# EAGLE design amplificador_stereo (EAGLE 9.6.0)
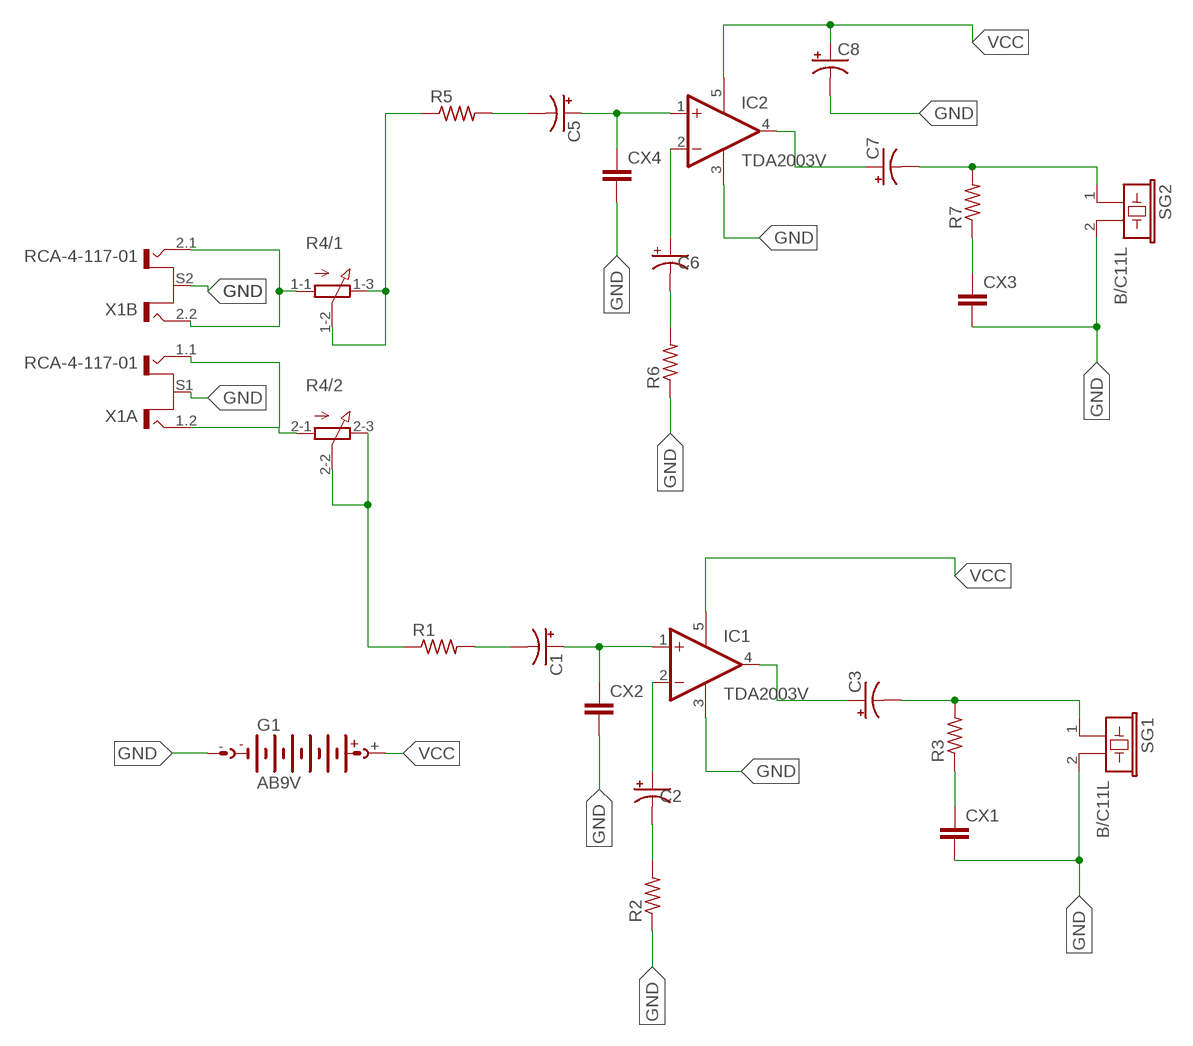
[diagram p0: schematic, sheet 1]

## Parts
C1  CPOL-USB45181B  [B45181B]
C2  CPOL-USB45181B  [B45181B]
C3  CPOL-USB45181B  [B45181B]
C5  CPOL-USB45181B  [B45181B]
C6  CPOL-USB45181B  [B45181B]
C7  CPOL-USB45181B  [B45181B]
C8  CPOL-USB45181B  [B45181B]
CX1  CXXC10B6  [XC10B6]
CX2  CXXC10B6  [XC10B6]
CX3  CXXC10B6  [XC10B6]
CX4  CXXC10B6  [XC10B6]
G1  AB9V  [AB9V]
IC1  TDA2003V  [CB360]
IC2  TDA2003V  [CB360]
R1  R-US_0204/7  [0204/7]
R2  R-US_0204/7  [0204/7]
R3  R-US_0204/7  [0204/7]
R4  3RP/1610G  [3RP/1610G]
R5  R-US_0204/7  [0204/7]
R6  R-US_0204/7  [0204/7]
R7  R-US_0204/7  [0204/7]
SG1  B/C11L  [B/C11L]
SG2  B/C11L  [B/C11L]
X1  RCA-4-117-01  [RCA-4-117-01]

## Nets
GND: C8.- CX1.2 CX2.2 CX3.2 CX4.2 G1.- IC1.3(GND) IC2.3(GND) R2.1 R6.1 SG1.2 SG2.2 X1.S1(A:S) X1.S2(B:S)
N$1: C1.- R1.2
N$2: C1.+ CX2.1 IC1.1(+IN)
N$3: C2.+ IC1.2(-IN)
N$4: C2.- R2.2
N$5: R1.1 R4.2-2(/2:S) R4.2-3(/2:E)
N$6: C3.+ IC1.4(OUT)
N$7: C3.- R3.2 SG1.1
N$8: CX1.1 R3.1
N$9: R4.1-1(/1:A) X1.2.1(B:T1) X1.2.2(B:T2)
N$10: C5.- R5.2
N$11: C5.+ CX4.1 IC2.1(+IN)
N$12: C6.+ IC2.2(-IN)
N$13: C6.- R6.2
N$14: C7.+ IC2.4(OUT)
N$15: C7.- R7.2 SG2.1
N$16: CX3.1 R7.1
N$17: R4.1-2(/1:S) R4.1-3(/1:E) R5.1
N$18: R4.2-1(/2:A) X1.1.1(A:T1) X1.1.2(A:T2)
VCC: C8.+ G1.+ IC1.5(V+) IC2.5(V+)

## Library data of the parts
C1-C3 C5-C8 = rcl:CPOL-US: POLARIZED CAPACITOR, American symbol; SPICEPREFIX: C
CX1-CX4 = rcl:CX: X CAPACITOR for power line; SPICEPREFIX: C
G1 = battery:AB9V: 9-V BATTERY CLIP
IC1 IC2 = linear:TDA2003: AUDIO AMPLIFIER
R1-R3 R5-R7 = rcl:R-US_: RESISTOR, American symbol; SPICEPREFIX: R
R4 = pot:3RP/1610G: 16mm Potentiometer two level Source: http://www.alphapotentiometers.net/html/16mm_pot_2.html
SG1 SG2 = buzzer:B/C11L: BUZZER Source: Buerklin; OC_FARNELL: unknown; OC_NEWARK: unknown
X1 = con-amphenol:RCA-4-117-01: RCA JACK DIP R/A 4pos Source: RCA-4-117-01x.pdf

## Board
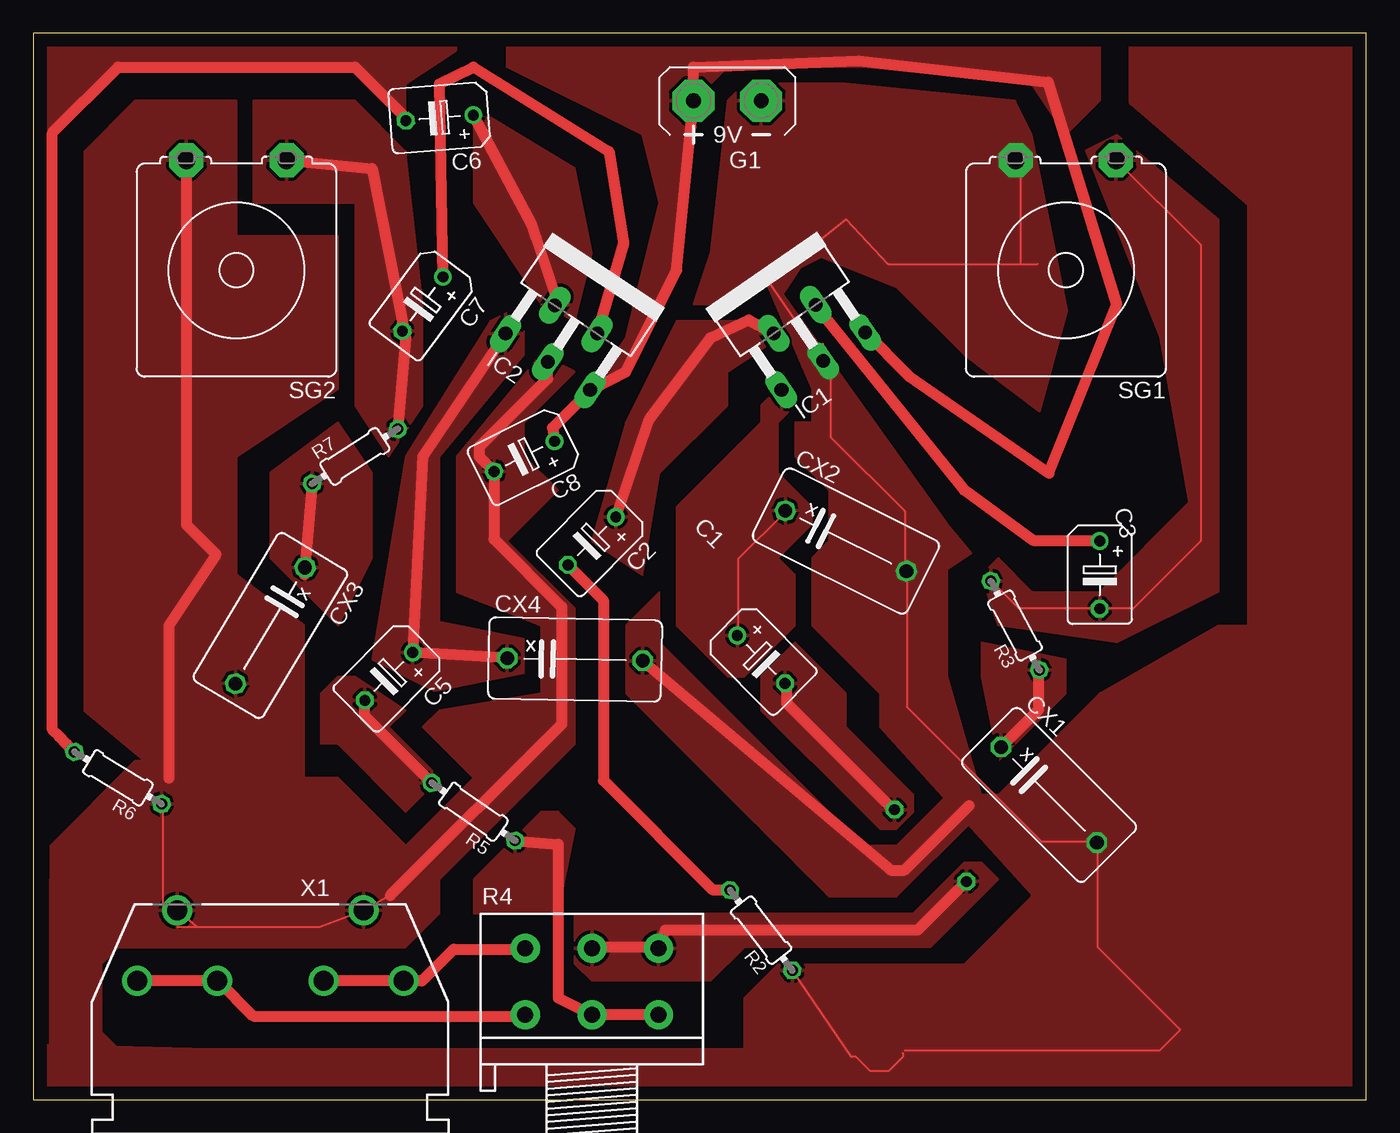
[diagram p1: board, top side]
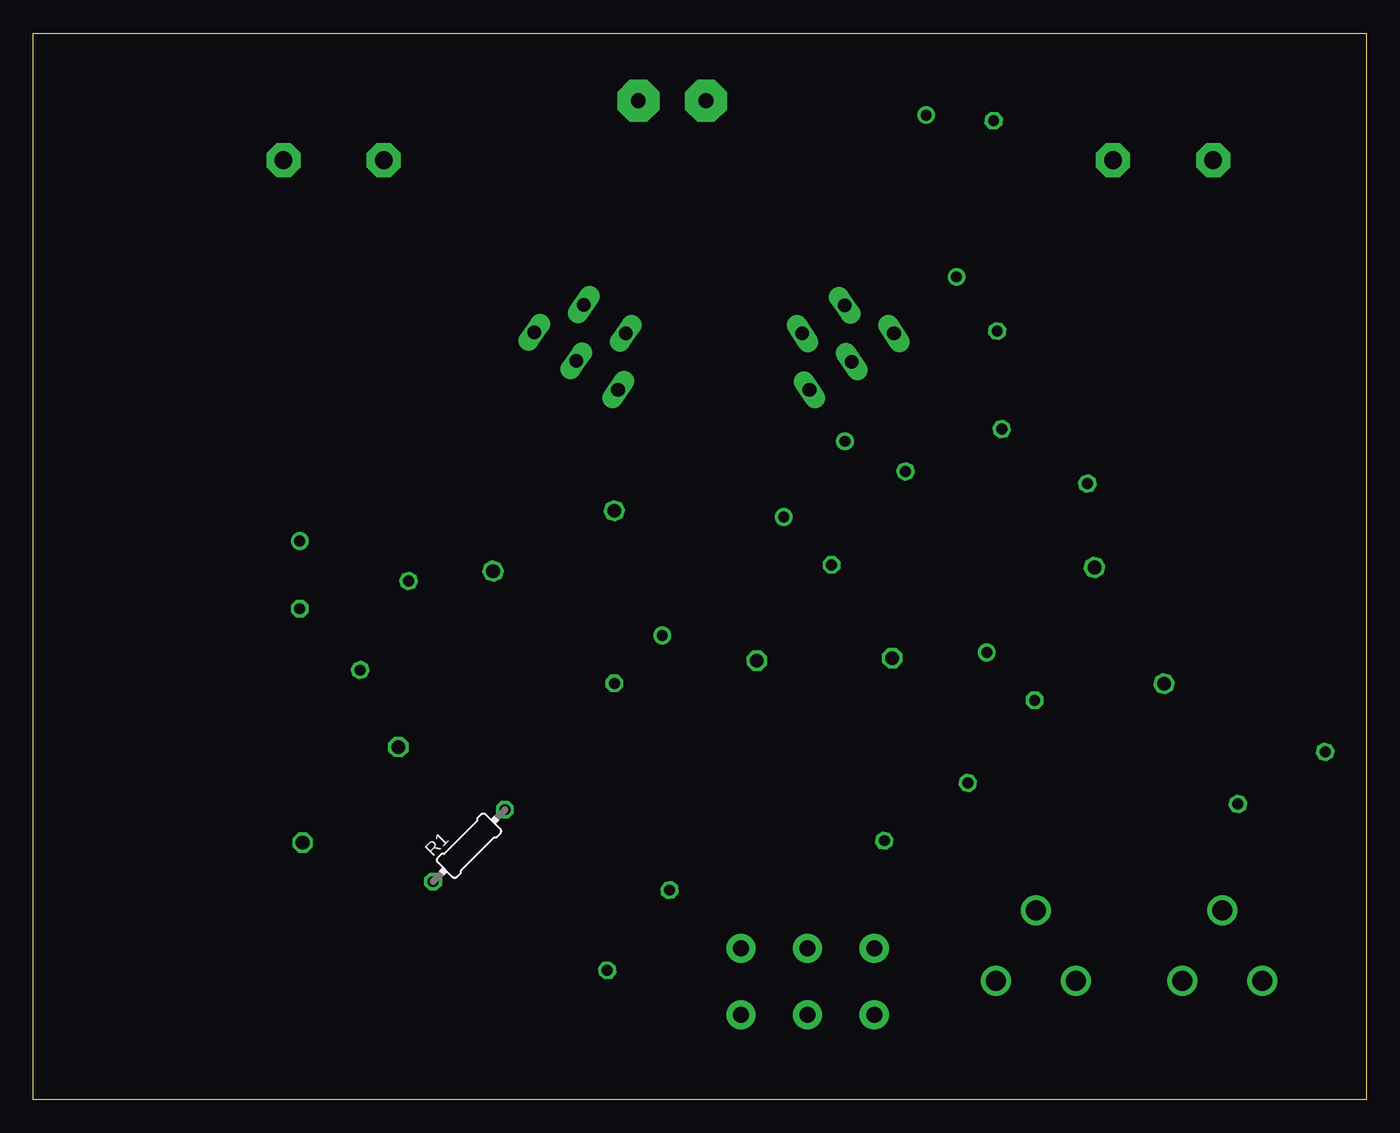
[diagram p2: board, bottom side, seen from below]

Size 100 x 80 mm. Coordinates in mm from the lower left corner, seen from the top.
Outline: 0,0 100,0 100,80 0,80 0,0
Copper layers (1*16): Top 0.035mm / dielectric 1.5mm / Bottom 0.035mm
Design rules "default": minimum track width 6mil, minimum drill 0.35mm, track to track 6mil, track to pad 6mil, pad to pad 6mil, via to via 6mil, smd to smd 6mil, copper to edge 40mil, drill to drill 6mil, minimum pad ring 10mil, minimum via ring 8mil, stop-mask expansion 4mil, vias tented up to drill 0mil, thermal gap 10mil

### Footprints (pad centres in the part's own frame; a part is rotated, then mirrored left to right if it is on the bottom)
B45181B = drill 0.813: + -2.54,0 | drill 0.813 octagon: - 2.54,0
XC10B6 = drill 1.016 octagon: 1 -5.08,0; 2 5.08,0
AB9V = drill 1.118 pad 3.15 octagon: + 0,2.54; - 0,-2.54
CB360 = drill 1.016 long: 1 -3.81,-8.255; 2 -1.905,-4.445; 3 0,-8.255; 4 1.905,-4.445; 5 3.81,-8.255
0204/7 = drill 0.813 octagon: 1 -3.81,0; 2 3.81,0
3RP/1610G = drill 1.2 pad 2.184: 1-1 -5,0; 1-2 0,0; 1-3 5,0; 2-1 -5,5; 2-2 0,5; 2-3 5,5
B/C11L = drill 1.321 pad 2.54 octagon: 1 -3.759,-8.255; 2 3.759,-8.255
RCA-4-117-01 = drill 1.5 pad 2.184: 1.1 -10,0; 1.2 -4,0; 2.1 4,0; 2.2 10,0; S1 -7,-5.3; S2 7,-5.3

### Placement (x,y rotation side)
C1  54.61,33.02 315 top
C2  41.91,41.91 225 top
C3  80.01,39.37 270 top
C5  26.67,31.75 225 top
C6  30.48,73.66 184.6 top
C7  29.21,59.69 233.2 top
C8  36.83,48.26 206.5 top
CX1  76.2,22.86 315 top
CX2  60.96,41.91 333.5 top
CX3  17.78,35.56 239.1 top
CX4  40.64,33.02 358.9 top
G1  52.07,74.93 90 top
IC1  54.61,62.23 34.4 top
IC2  43.18,62.23 326.3 top
R1  67.31,19.05 45 bottom
R2  54.61,12.7 127.9 top
R3  73.66,35.56 118.6 top
R4  41.91,6.35 0 top
R5  33.02,21.59 145.3 top
R6  6.35,24.13 149.1 top
R7  24.13,48.26 32.5 top
SG1  77.47,62.23 180 top
SG2  15.24,62.23 180 top
X1  17.78,8.89 180 top

### Tracks (layer width: path | path; a pad name or v marks a point on that pad's centre or on a via)
GND
  Top 0.152: 65.23,3.5 65.23,3.2 64.16,2.13 62.79,2.13 61.72,3.2 61.39,3.2 R2.1 | 65.38,3.66 84.48,3.66 86.06,5.23 79.86,11.43 79.86,19.2 CX1.2 79.7,19.36 75.64,19.36 65.53,29.46 65.53,39.62 CX2.2 65.38,39.78 65.38,44.15 59.85,49.67 59.85,54.02 arc45 IC1.3 | 74.07,62.69 74.07,70.1 73.76,70.41 SG1.2 | 74.07,62.69 64.13,62.69 60.96,66.04 55.17,61.41 IC1.3 | 74.07,62.69 75.34,62.69 | IC1.3 59.27,56.69 | R6.1 9.75,22.1 9.75,14.5 X1.S2 12.25,12.95 | 10.82,12.95 21.46,12.95 X1.S1 26.78,15.3 | 34.7,47.19 C8.-
  Top 0.813: 70.23,22.07 65.36,17.2 64.33,17.2 CX4.2 | 26.78,15.3 39.64,28.16 39.64,36.97 34.56,42.05 C8.- 33.45,48.23 33.45,48.95 38.6,54.09 IC2.3 | SG2.2 11.48,43.13 13.72,40.89 10.16,35.56 10.16,24.13
  pour Top (no thermals): 63.5,27.94 76.2,13.97 82.55,6.35 85.46,2.47 88.9,7.62 82.09,12.48 83.82,22.86 71.12,22.86 68.58,31.75 68.58,43.18 56.25,60.44 58.32,63.54 64.77,60.96 69.85,55.88 75.52,51.63 77.57,59.18 74.93,72.39 64.77,73.66 54.61,62.23 58.42,53.34 58.42,48.26 63.5,38.1
  pour Top: 54.61,3.81 60.96,3.81 62.23,2.54 63.5,2.54 63.5,3.81 64.77,5.08 68.58,5.08 69.85,3.81 82.55,3.81 82.55,7.62 85.09,10.16 91.44,10.16 92.71,8.89 92.71,1.27 53.34,1.27 53.34,2.54
  pour Top: 72.39,22.86 80.01,30.48 88.9,35.56 92.71,35.56 92.71,6.35 81.28,8.89
  pour Top: 8.89,25.4 7.62,25.4 1.27,19.05 1.27,16.51 3.81,13.97 6.35,11.43 27.94,11.43 30.48,13.97 30.48,16.51 22.86,24.13 11.43,24.13 10.16,25.4
  pour Top: 53.34,3.81 53.34,7.62 55.88,10.16 69.85,10.16 74.93,15.24 74.93,16.51 83.82,7.62 85.09,7.62 83.82,6.35 83.82,3.81 80.01,0 46.99,0 1.27,0 1.27,16.51 3.81,16.51 7.62,12.7 5.08,10.16 5.08,5.08 6.35,3.81 11.43,3.81
  pour Top: 82.55,80.01 82.55,74.93 91.44,67.31 91.44,34.29 82.55,5.08 48.26,2.54 -1.27,3.81 1.27,-3.81 107.95,-5.08 104.14,82.55 82.55,81.28
  pour Top: 44.45,35.56 44.45,30.48 59.69,15.24 64.77,15.24 70.48,20.95 68.58,22.86 64.77,19.05 62.23,19.05 46.99,34.29 46.99,38.1
  pour Top: 52.07,74.93 50.8,63.5 49.53,59.69 52.07,59.69 59.69,63.5 74.93,72.39 73.66,74.93 60.96,76.2 53.34,76.2
  pour Top: 7.62,74.93 3.81,71.12 3.81,29.21 11.43,22.86 20.32,22.86 20.32,35.56 15.24,39.37 15.24,48.26 22.86,53.34 22.86,64.77 15.24,64.77 15.24,74.93
  pour Top: 38.1,55.88 31.75,48.26 31.75,38.1 38.1,35.56 38.1,30.48 30.48,29.21 29.21,27.94 33.02,24.13 27.94,19.05 27.94,16.51 30.48,16.51 40.64,26.67 40.64,36.83 35.56,41.91 39.37,45.72 36.83,48.26 36.83,50.8 40.64,54.61
  pour Top: 57.15,50.8 57.15,48.26 59.69,45.72 59.69,41.91 58.42,40.64 58.42,35.56 63.5,30.48 68.58,31.75 68.58,39.79 70.39,41 70.39,41 62.23,50.8
N$1
  Top 0.152: 56.54,31.09 C1.- | 64.47,21.79 R1.2
  Top 0.813: 56.54,31.09 56.54,29.72 64.47,21.79
  pour Top: 54.61,31.75 54.61,29.21 62.23,21.59 63.5,20.32 64.77,20.32 66.04,21.59 66.04,22.86 60.96,27.94 60.96,30.48 57.15,34.29
N$2
  Top 0.152: C1.+ 52.88,34.9 52.88,40.54 56.39,44.04 CX2.1 56.39,44.2 56.24,44.35 | 56.24,53.19 IC1.1
  pour Top: 54.61,52.07 54.61,50.8 48.26,44.45 48.26,35.56 52.07,31.75 53.34,31.75 57.15,35.56 57.15,39.37 55.88,40.64 58.42,43.18 58.42,44.45 55.88,46.99 55.88,50.8 57.15,52.07 55.88,53.34
N$3
  Top 0.152: 43.74,43.74 C2.+ | 55.47,57.45 IC1.2
  Top 0.813: C2.+ 46.2,51.01 50.8,57.15 53.68,58.49 IC1.2
  pour Top: 48.26,58.42 44.45,50.8 41.91,41.91 45.72,39.37 46.99,46.99 52.07,52.07 52.07,54.61 55.88,57.15 54.61,58.42
N$4
  Top 0.813: C2.- 42.77,37.45 42.77,23.93 50.99,15.71 R2.2
N$5
  Top 0.152: 41.91,11.43 R4.2-2 | 46.79,11.43 R4.2-3
  Top 0.813: 46.79,11.43 41.91,11.43 | R1.1 66.34,12.7 47.4,12.7 R4.2-3
  pour Top: 71.12,17.78 72.39,16.51 67.31,11.43 53.34,11.43 50.8,8.89 41.91,8.89 40.64,10.16 40.64,13.97 66.04,13.97 69.85,17.78
N$6
  Top 0.152: 58.67,59.59 58.68,59.59 IC1.4
  Top 0.813: C3.+ 75.08,41.91 69.85,45.72 58.68,59.59
N$7
  Top 0.152: 80.01,36.88 73.91,36.88 71.93,38.86 R3.2 | 80.01,36.88 82.55,36.88 87.58,41.91 87.58,64.14 SG1.1 | 80.01,36.88 C3.-
  pour Top: 72.39,40.64 74.93,38.1 80.01,38.1 86.74,44.83 84.56,57.22 78.95,71.23 81.28,72.39 88.9,66.04 88.9,38.1 81.28,34.29 72.39,35.56 71.12,39.37
N$8
  Top 0.152: 75.44,32.16 R3.1 | 72.69,26.52 CX1.1
  Top 0.813: 75.44,32.16 75.44,29.26 72.69,26.52
  pour Top: 71.12,34.29 71.12,31.75 72.39,25.4 77.47,30.48 77.47,33.02
N$9
  Top 0.152: 36.91,6.28 R4.1-1
  Top 0.813: 36.91,6.28 36.88,6.25 16.51,6.25 13.87,8.89 X1.2.1 X1.2.2
N$10
  Top 0.152: 29.87,23.88 R5.2
  Top 0.813: R5.2 24.87,28.77 C5.-
  pour Top: 24.13,31.75 27.94,29.21 26.67,27.94 30.48,24.13 27.94,21.59 22.86,26.67 21.59,26.67 21.59,30.48 22.86,31.75
N$11
  Top 0.152: 35.36,57.45 IC2.1
  Top 0.813: CX4.1 C5.+ 29.21,48.26 IC2.1
  pour Top: 34.29,58.42 27.94,48.26 25.4,33.02 30.12,30.66 36.83,32 36.83,34.54 30.48,35.81 30.48,48.26 36.83,55.88 36.83,59.69
N$12
  Top 0.813: 39.37,59.69 37.72,64.64 37.41,65.58 C6.+
  pour Top: 33.02,73.66 33.02,67.31 38.1,59.69 40.64,58.42 41.91,63.5 40.64,69.85 34.29,73.66
N$13
  Top 0.813: R6.2 2.52,26.65 1.94,27.23 1.42,27.75 1.42,72.54 6.35,77.47 24.13,77.47 27.95,73.65 C6.-
  pour Top: 27.94,73.66 27.94,76.2 31.75,78.74 31.75,82.55 -1.27,82.55 -1.27,64.77 1.27,63.5 1.27,72.39 6.35,77.47 24.13,77.47
N$14
  Top 0.152: 42.22,57.61 IC2.4
  Top 0.813: IC2.4 44.3,64.25 43.18,71.12 33.02,77.47 30.48,76.2 C7.+
N$15
  Top 0.152: 19,69.9 SG2.1
  Top 0.813: SG2.1 25.4,69.85 27.94,57.15 R7.2
  pour Top: 16.51,74.93 16.51,67.31 24.13,67.31 24.13,52.07 26.67,48.26 29.21,52.07 29.21,59.69 27.94,71.12 24.13,74.93
N$16
  Top 0.813: R7.1 20.32,39.37 CX3.1
  pour Top: 17.78,46.99 17.78,40.64 22.86,35.56 25.4,40.64 25.4,46.99 22.86,50.8
N$17
  Top 0.152: 36.27,19.3 R5.1 | 46.79,6.4 R4.1-3 | 41.91,6.4 R4.1-2
  Top 0.813: 41.91,6.4 46.79,6.4 | R5.1 39.37,19.16 39.37,7.62 R4.1-2
  pour Top: 38.1,21.59 33.02,16.51 33.02,13.97 39.37,13.97 40.64,20.32 39.37,21.59
N$18
  Top 0.152: 36.88,11.28 R4.2-1
  Top 0.813: 36.88,11.28 31.55,11.28 29.16,8.89 X1.1.1 X1.1.2
VCC
  Top 0.152: 41.67,52.73 41.76,53.19 IC2.5 41.91,53.34
  Top 0.813: 65.8,54.19 65.71,54.28 | 65.71,54.28 IC1.5 | 41.76,53.19 38.95,50.38 C8.+ | 65.71,54.28 76.2,46.99 81.28,59.69 76.16,76.35 61.94,77.92 49.53,77.47 G1.+ 48.26,62.23 44.45,54.61 IC2.5
  pour Top: 81.28,82.55 80.01,80.01 80.01,74.93 77.47,72.39 74.93,76.2 62.23,77.47 52.07,77.47 49.53,74.93 48.26,63.5 44.45,54.61 41.91,53.34 44.45,57.15 46.99,67.31 45.72,72.39 35.56,77.47 35.56,81.28